# Altium schematic sheet vreg.SchDoc
size A4; Revision: 1; SheetNumber: 5; SheetTotal: 5
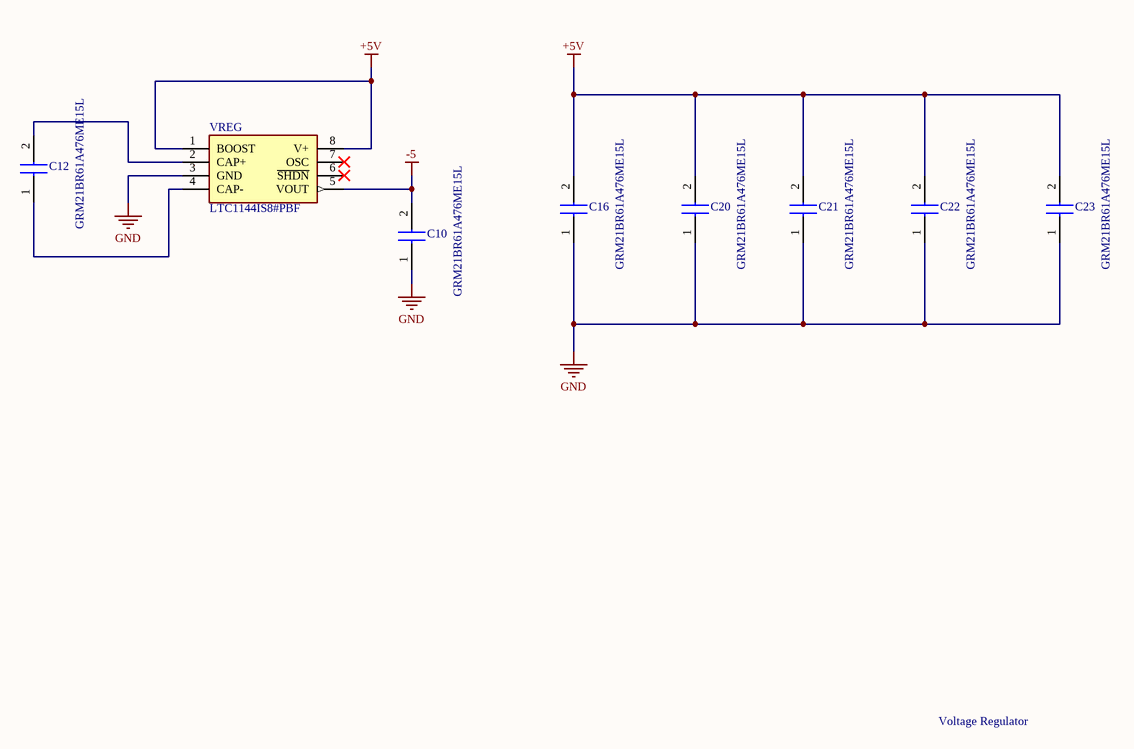
[diagram p0: vreg.SchDoc]

## Parts
C10  GRM21BR61A476ME15L  [CAPC2012X145N]
C12  GRM21BR61A476ME15L  [CAPC2012X145N]
C16  GRM21BR61A476ME15L  [CAPC2012X145N]
C20  GRM21BR61A476ME15L  [CAPC2012X145N]
C21  GRM21BR61A476ME15L  [CAPC2012X145N]
C22  GRM21BR61A476ME15L  [CAPC2012X145N]
C23  GRM21BR61A476ME15L  [CAPC2012X145N]
VREG  LTC1144IS8#PBF  [SOIC127P599X175-8N]

## Nets
+5V: C16.2 C20.2 C21.2 C22.2 C23.2 VREG.1(BOOST) VREG.8(V+)
-5: C10.2 VREG.5(VOUT)
GND: C10.1 C16.1 C20.1 C21.1 C22.1 C23.1 VREG.3(GND)
NetC12_1: C12.1 VREG.4(CAP-)
NetC12_2: C12.2 VREG.2(CAP+)

Not connected (* = marked no-connect by the designer): VREG 6(~{SHDN})* 7(OSC)*

## Notes on the sheet
- Voltage Regulator

## Library data of the parts
C10 C12 C16 C20-C23 = GRM21BR61A476ME15L: Capacitor; Manufacturer_Name: Murata Electronics; Datasheet Link: https://search.murata.co.jp/Ceramy/image/img/A01X/G101/ENG/GRM21BR61A476ME15-01A.pdf; Height: 1.45mm; Manufacturer_Part_Number: GRM21BR61A476ME15L; Mouser Part Number: 81-GRM21BR61A476ME5L; Mouser Price/Stock: https://www.mouser.co.uk/ProductDetail/Murata-Electronics/GRM21BR61A476ME15L?qs=hNud%2FORuBR2%2FEB7WUpdltg%3D%3D; Arrow Part Number: GRM21BR61A476ME15L; Arrow Price/Stock: https://www.arrow.com/en/products/grm21br61a476me15l/murata-manufacturing?utm_currency=USD&region=nac
VREG = LTC1144IS8#PBF: Integrated Circuit; Manufacturer_Name: Analog Devices; Datasheet Link: http://cds.linear.com/docs/en/datasheet/1144fa.pdf; Height: 1.752mm; Manufacturer_Part_Number: LTC1144IS8#PBF; Mouser Part Number: 584-LTC1144IS8#PBF; Mouser Price/Stock: https://www.mouser.co.uk/ProductDetail/Analog-Devices/LTC1144IS8PBF?qs=hVkxg5c3xu%2FkbkSDzzDboA%3D%3D; Arrow Part Number: LTC1144IS8#PBF; Arrow Price/Stock: https://www.arrow.com/en/products/ltc1144is8pbf/analog-devices?utm_currency=USD&region=europe